# Altium schematic sheet 13_SPI_Flash.SchDoc
size A4
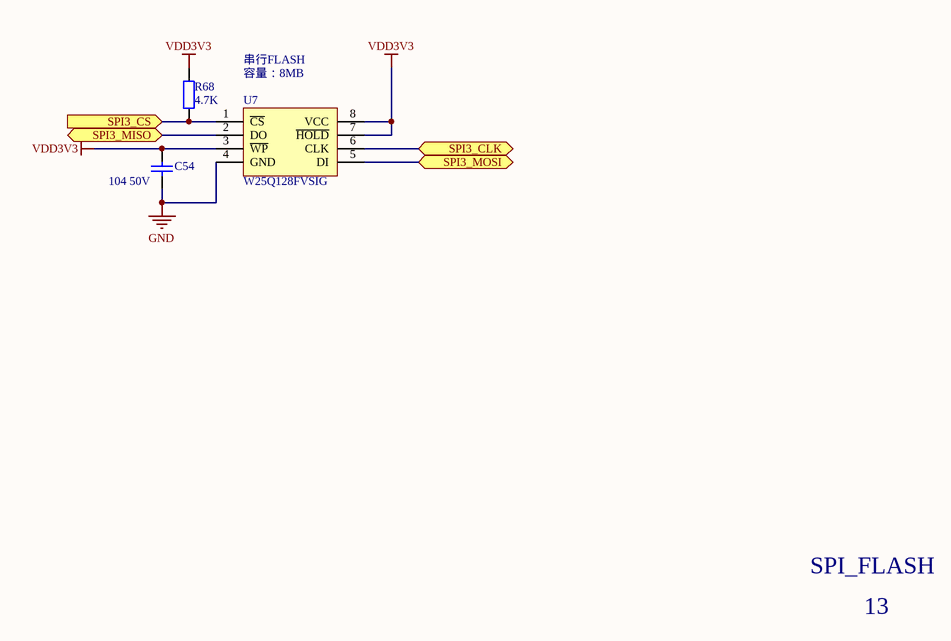
[diagram p0: 13_SPI_Flash.SchDoc]

## Parts
C54  104 50V  [SMD-0603C]
R68  4.7K  [SMD-0603]
U7  W25Q128FVSIG  [SO-8W]

## Ports
SPI3_CLK (bidir), SPI3_CS (in), SPI3_MISO (bidir), SPI3_MOSI (bidir)

## Nets
GND: C54.2 U7.4(GND)
VDD3V3: C54.1 R68.1 U7.3(~{WP}) U7.7(~{HOLD}) U7.8(VCC)
SPI3_CLK: U7.6(CLK) ; port SPI3_CLK
SPI3_CS: R68.2 U7.1(~{CS}) ; port SPI3_CS
SPI3_MISO: U7.2(DO) ; port SPI3_MISO
SPI3_MOSI: U7.5(DI) ; port SPI3_MOSI

## Notes on the sheet
- 串行FLASH
- 容量：8MB
- SPI_FLASH
- 13

## Library data of the parts
C54 = CAP4: 贴片电容 20%
R68 = RES2: 贴片电阻 5%
U7 = W25Q128FV